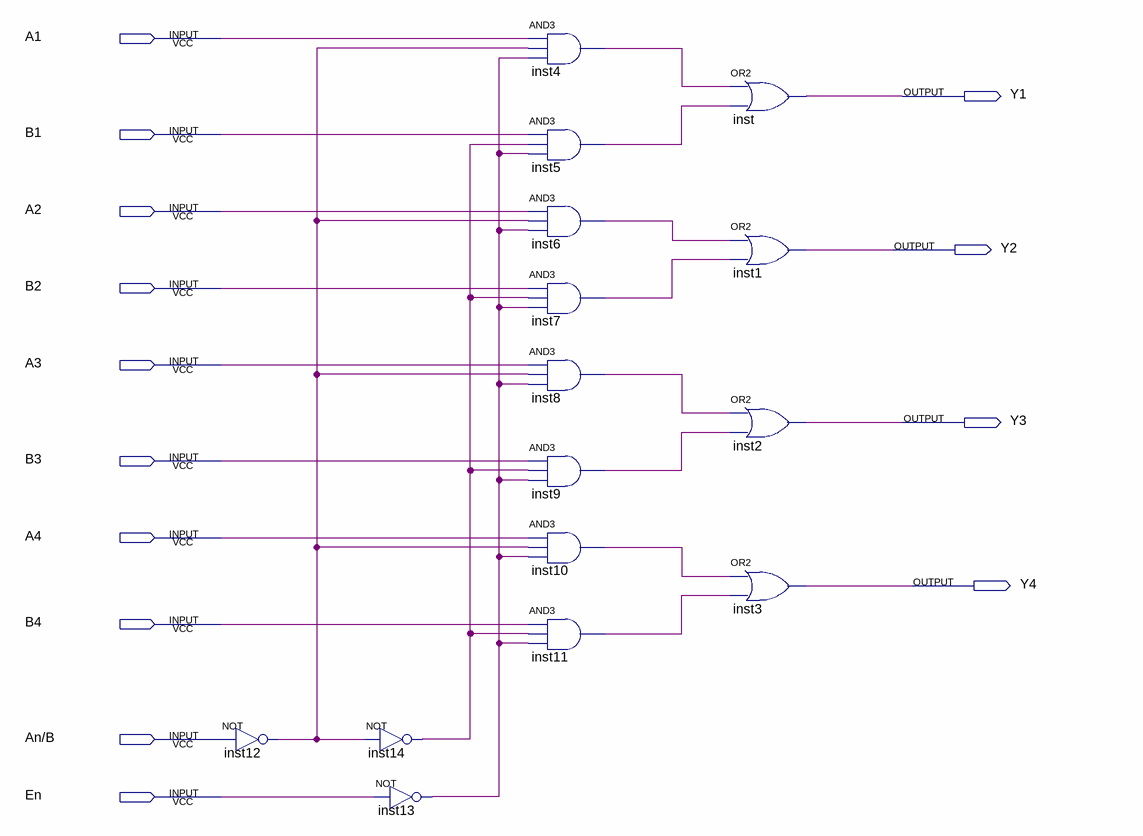
[diagram p0: schematic sheet]
// Quartus schematic DeMUX_endereco.bdf as structural Verilog: 15 symbols, 14 pins
module DeMUX_endereco (
  input  A1,
  input  B1,
  input  A2,
  input  B2,
  input  A3,
  input  B3,
  input  A4,
  input  B4,
  input  \An/B ,
  input  En,
  output Y1,
  output Y2,
  output Y3,
  output Y4
);

  wire inst4_out, inst5_out, inst6_out, inst7_out, inst8_out, inst9_out, inst10_out, inst11_out, inst12_out,
       inst13_out, inst14_out;

  not inst12 (inst12_out, \An/B );
  not inst14 (inst14_out, inst12_out);
  not inst13 (inst13_out, En);
  and inst4 (inst4_out, A1, inst12_out, inst13_out);
  and inst5 (inst5_out, B1, inst14_out, inst13_out);
  and inst6 (inst6_out, A2, inst12_out, inst13_out);
  and inst7 (inst7_out, B2, inst14_out, inst13_out);
  and inst8 (inst8_out, A3, inst12_out, inst13_out);
  and inst9 (inst9_out, B3, inst14_out, inst13_out);
  and inst10 (inst10_out, A4, inst12_out, inst13_out);
  and inst11 (inst11_out, B4, inst14_out, inst13_out);
  or inst (Y1, inst4_out, inst5_out);
  or inst1 (Y2, inst6_out, inst7_out);
  or inst2 (Y3, inst8_out, inst9_out);
  or inst3 (Y4, inst10_out, inst11_out);
endmodule
